# EAGLE design main (EAGLE 7.6.0)
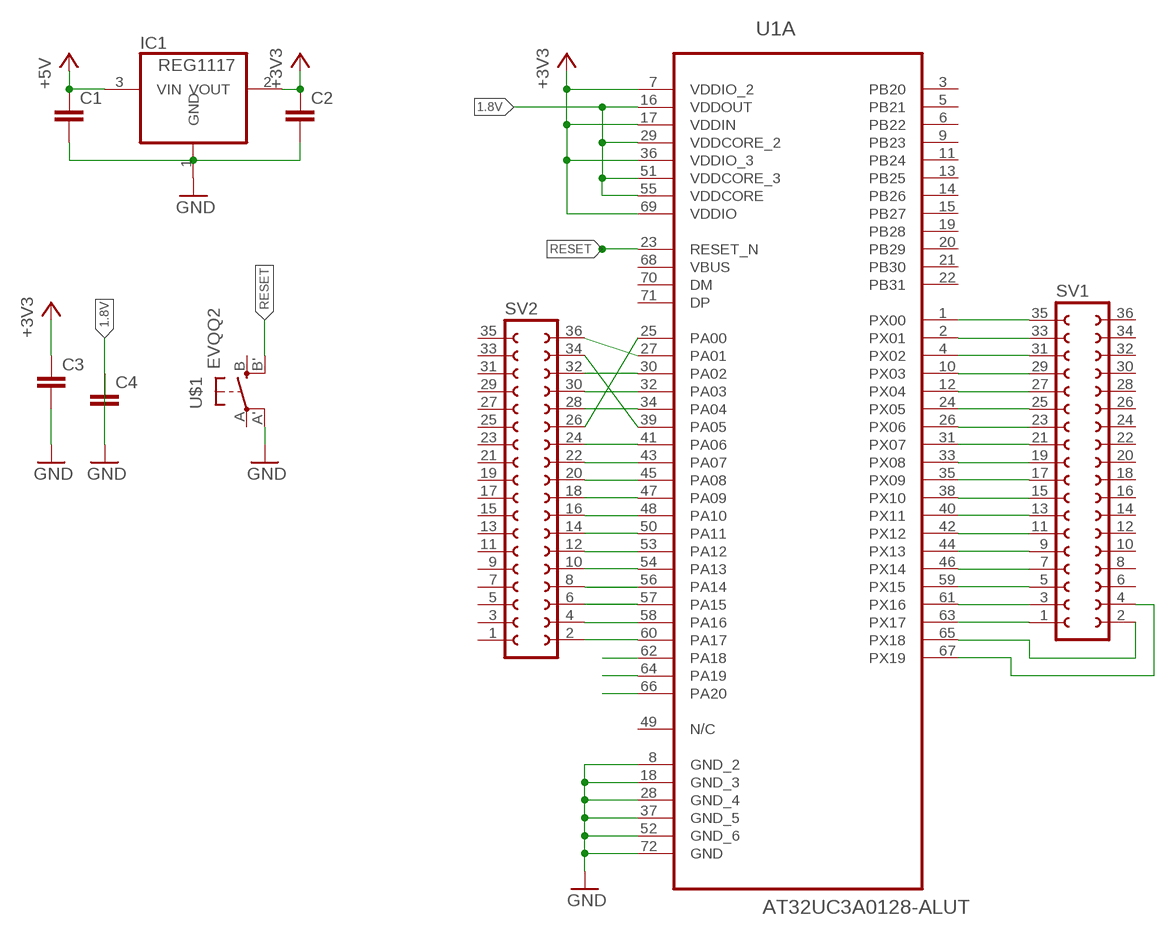
[diagram p0: schematic, sheet 1]

## Parts
C1  C-EUC0805K  [C0805K]
C2  C-EUC0805K  [C0805K]
C3  C-EUC0805K  [C0805K]
C4  C-EUC0805K  [C0805K]
IC1  REG1117  [SOT223]
SV1  FE18-2  [FE18-2]
SV2  FE18-2  [FE18-2]
U1  AT32UC3A0128-ALUT  [QFP50P2200X2200X160-144N]
U$1  EVQQ2  [EVQ-Q2]

## Nets
1.8V: C4.2 U1.16(A:VDDOUT) U1.29(A:VDDCORE_2) U1.51(A:VDDCORE_3) U1.55(A:VDDCORE)
+3V3: C2.1 C3.1 IC1.2(VOUT) U1.7(A:VDDIO_2) U1.17(A:VDDIN) U1.36(A:VDDIO_3) U1.69(A:VDDIO)
+5V: C1.1 IC1.3(VIN)
GND: C3.2 C4.1 IC1.1(GND) U1.8(A:GND_2) U1.18(A:GND_3) U1.28(A:GND_4) U1.37(A:GND_5) U1.52(A:GND_6) U1.72(A:GND) U$1.A'(P1)
N$1: C1.2 C2.2
N$2: SV1.35 U1.1(A:PX00)
N$3: SV1.33 U1.2(A:PX01)
N$4: SV1.31 U1.4(A:PX02)
N$5: SV1.29 U1.10(A:PX03)
N$6: SV1.27 U1.12(A:PX04)
N$7: SV1.25 U1.24(A:PX05)
N$8: SV1.23 U1.26(A:PX06)
N$9: SV1.21 U1.31(A:PX07)
N$10: SV1.19 U1.33(A:PX08)
N$11: SV1.17 U1.35(A:PX09)
N$12: SV1.15 U1.38(A:PX10)
N$13: SV1.13 U1.40(A:PX11)
N$14: SV1.11 U1.42(A:PX12)
N$15: SV1.9 U1.44(A:PX13)
N$16: SV1.7 U1.46(A:PX14)
N$17: SV1.5 U1.59(A:PX15)
N$18: SV1.3 U1.61(A:PX16)
N$19: SV1.1 U1.63(A:PX17)
N$20: SV2.26 U1.25(A:PA00)
N$21: SV2.36 U1.27(A:PA01)
N$22: SV2.32 U1.30(A:PA02)
N$23: SV2.30 U1.32(A:PA03)
N$24: SV2.28 U1.34(A:PA04)
N$25: SV2.34 U1.39(A:PA05)
N$26: SV2.24 U1.41(A:PA06)
N$27: SV2.22 U1.43(A:PA07)
N$28: SV2.20 U1.45(A:PA08)
N$29: SV2.18 U1.47(A:PA09)
N$30: SV2.16 U1.48(A:PA10)
N$31: SV2.14 U1.50(A:PA11)
N$32: SV2.12 U1.53(A:PA12)
N$33: SV2.10 U1.54(A:PA13)
N$34: SV2.8 U1.56(A:PA14)
N$35: SV2.6 U1.57(A:PA15)
N$36: SV2.4 U1.58(A:PA16)
N$37: SV2.2 U1.60(A:PA17)
N$38: U1.62(A:PA18)
N$39: U1.64(A:PA19)
N$40: U1.66(A:PA20)
N$41: SV1.2 U1.65(A:PX18)
N$42: SV1.4 U1.67(A:PX19)
RESET: U1.23(A:RESET_N) U$1.B'(S1)
Unconnected: SV1.6 SV1.8 SV1.10 SV1.12 SV1.14 SV1.16 SV1.18 SV1.20 SV1.22 SV1.24 SV1.26 SV1.28 SV1.30 SV1.32 SV1.34 SV1.36 SV2.1 SV2.3 SV2.5 SV2.7 SV2.9 SV2.11 SV2.13 SV2.15 SV2.17 SV2.19 SV2.21 SV2.23 SV2.25 SV2.27 SV2.29 SV2.31 SV2.33 SV2.35 U1.3(A:PB20) U1.5(A:PB21) U1.6(A:PB22) U1.9(A:PB23) U1.11(A:PB24) U1.13(A:PB25) U1.14(A:PB26) U1.15(A:PB27) U1.19(A:PB28) U1.20(A:PB29) U1.21(A:PB30) U1.22(A:PB31) U1.49(A:N/C) U1.68(A:VBUS) U1.70(A:DM) U1.71(A:DP) U1.73(B:PA21) U1.74(B:PA22) U1.75(B:PA23) U1.76(B:PA24) U1.77(B:PA25) U1.78(B:PA26) U1.79(B:PA27) U1.80(B:PA28) U1.82(B:ADVREF) U1.83(B:GNDANA) U1.85(B:PC00) U1.86(B:PC01) U1.87(B:PX20) U1.88(B:PB00) U1.89(B:PX21) U1.90(B:PB01) U1.91(B:PX22) U1.94(B:GND_2) U1.95(B:PX23) U1.96(B:PB02) U1.97(B:PX24) U1.98(B:PB03) U1.99(B:PX25) U1.100(B:PB04) U1.101(B:PX26) U1.102(B:PB05) U1.103(B:PX27) U1.104(B:PB06) U1.105(B:PX28) U1.106(B:PB07) U1.107(B:PX29) U1.109(B:GND_3) U1.110(B:PX30) U1.111(B:PB08) U1.112(B:PX31) U1.113(B:PB09) U1.114(B:PX32) U1.115(B:PB10) U1.117(B:GND) U1.118(B:PX33) U1.119(B:PB11) U1.120(B:PX34) U1.121(B:PB12) U1.122(B:PA29) U1.123(B:PA30) U1.124(B:PC02) U1.125(B:PC03) U1.126(B:PB13) U1.127(B:PB14) U1.128(B:TMS) U1.129(B:TCK) U1.130(B:TDO) U1.131(B:TDI) U1.132(B:PC04) U1.133(B:PC05) U1.134(B:PB15) U1.135(B:PX35) U1.136(B:PB16) U1.137(B:PX36) U1.139(B:PB17) U1.140(B:PX37) U1.141(B:PB18) U1.142(B:PX38) U1.143(B:PB19) U1.144(B:PX39) U$1.A(P) U$1.B(S)

## Power pins joined to a net without a drawn wire
VDDANA: U1.81(B:VDDANA)
VDDCORE: U1.138(B:VDDCORE)
VDDIO: U1.116(B:VDDIO)
VDDIO_2: U1.92(B:VDDIO_2)
VDDIO_3: U1.93(B:VDDIO_3)
VDDIO_4: U1.108(B:VDDIO_4)
VDDPLL: U1.84(B:VDDPLL)

## Library data of the parts
C1-C4 = rcl:C-EU: CAPACITOR, European symbol
IC1 = burr-brown:REG1117: 800mA and 1A Low Dropout (LDO) Positive Regulator 1.8V, 2.5V, 2.85V, 3.3V, 5V, and Adj; MPN: REG1117; OC_FARNELL: 1097566; OC_NEWARK: 14P6981
SV1 SV2 = con-lsta:FE18-2: FEMALE HEADER; OC_FARNELL: unknown; OC_NEWARK: unknown
U1 = Atmel_By_element14_Batch_1-00:AT32UC3A0128-ALUT: 32-Bit Microcontroller; DESCRIPTION: 32-Bit Microcontroller; MPN: AT32UC3A0128-ALUT; OC_FARNELL: 1841633; OC_NEWARK: 12T1368; PACKAGE: LQFP-144; SUPPLIER: Atmel Corporation
U$1 = adafruit:EVQQ2: SMT 6mm switch, EVQQ2 series http://www.ladyada.net/library/eagle

## Board
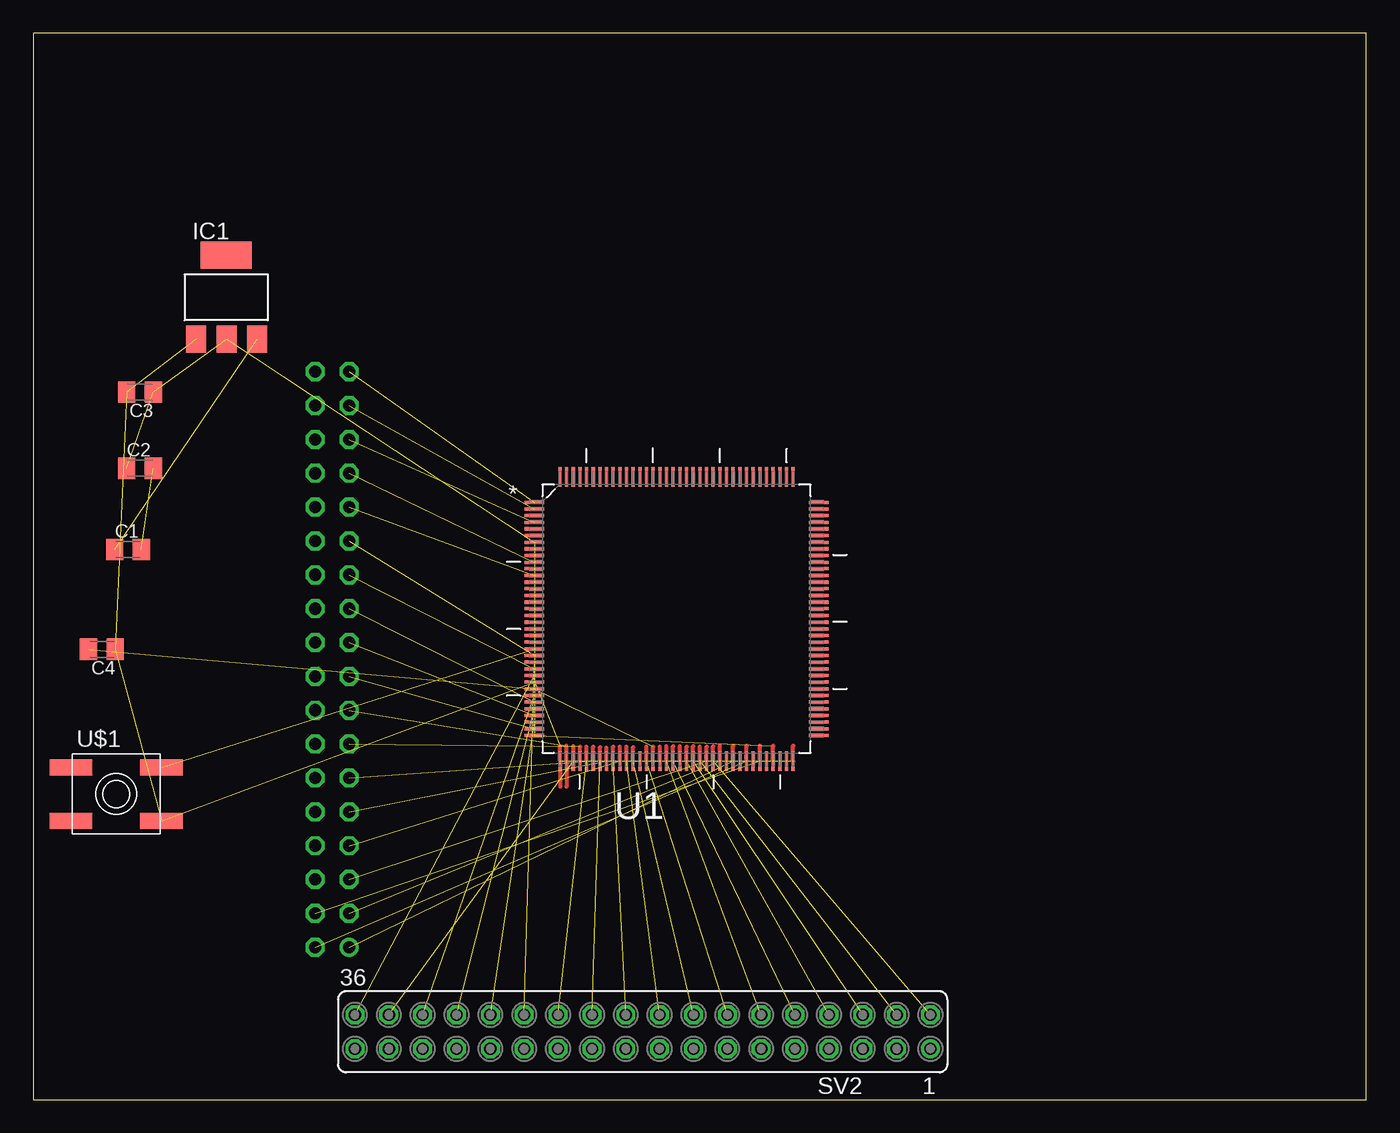
[diagram p1: board, top side]
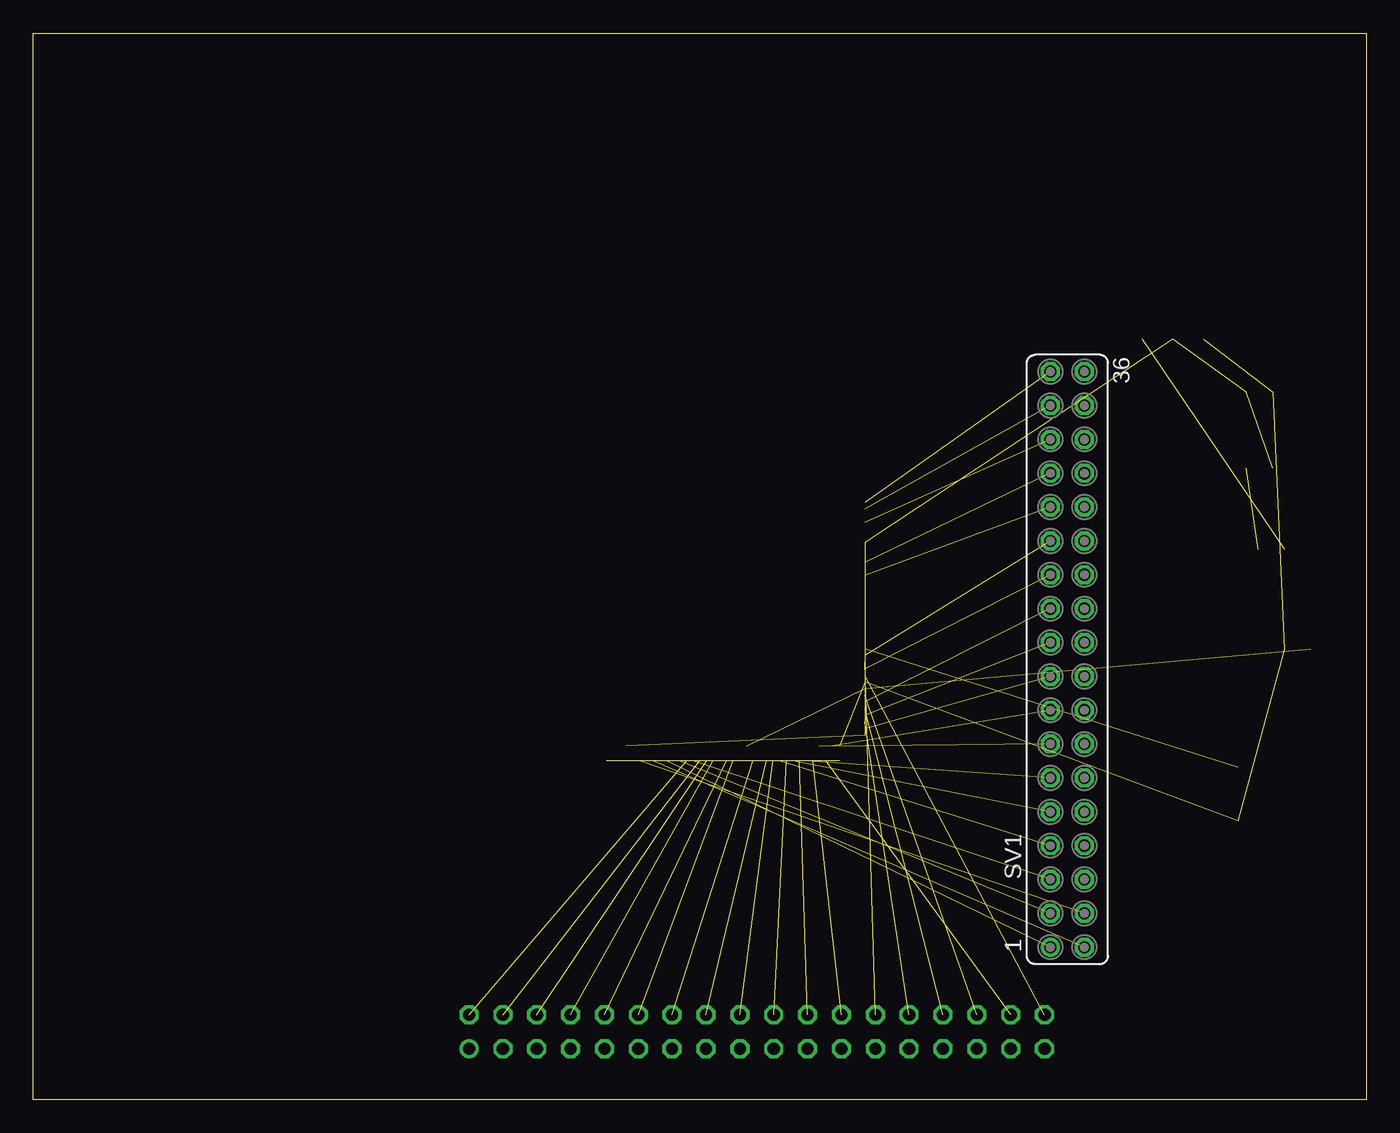
[diagram p2: board, bottom side, seen from below]

Size 100 x 80 mm. Coordinates in mm from the lower left corner, seen from the top.
Outline: 0,0 100,0 100,80 0,80 0,0
Copper layers (1*16): Top 0.035mm / dielectric 1.5mm / Bottom 0.035mm
Design rules "default": minimum track width 10mil, minimum drill 24mil, track to track 8mil, track to pad 8mil, pad to pad 8mil, via to via 8mil, smd to smd 8mil, copper to edge 40mil, drill to drill 8mil, minimum pad ring 10mil, minimum via ring 8mil, stop-mask expansion 4mil, vias tented up to drill 0mil, thermal gap 10mil

### Footprints (pad centres in the part's own frame; a part is rotated, then mirrored left to right if it is on the bottom)
C0805K = smd 1.3 x 1.6: 1 -1,0; 2 1,0
SOT223 = smd 1.499 x 2.007: 1 -2.261,-3.15; 2 0.025,-3.15; 3 2.311,-3.15 | smd 3.81 x 2.007: 4 0,3.15
FE18-2 = drill 0.914: 1 -21.59,1.27 | drill 0.914 octagon: 2 -21.59,-1.27; 3 -19.05,1.27; 4 -19.05,-1.27; 5 -16.51,1.27; 6 -16.51,-1.27; 7 -13.97,1.27; 8 -13.97,-1.27; 9 -11.43,1.27; 10 -11.43,-1.27; 11 -8.89,1.27; 12 -8.89,-1.27; 13 -6.35,1.27; 14 -6.35,-1.27; 15 -3.81,1.27; 16 -3.81,-1.27; 17 -1.27,1.27; 18 -1.27,-1.27; 19 1.27,1.27; 20 1.27,-1.27; 21 3.81,1.27; 22 3.81,-1.27; 23 6.35,1.27; 24 6.35,-1.27; 25 8.89,1.27; 26 8.89,-1.27; 27 11.43,1.27; 28 11.43,-1.27; 29 13.97,1.27; 30 13.97,-1.27; 31 16.51,1.27; 32 16.51,-1.27; 33 19.05,1.27; 34 19.05,-1.27; 35 21.59,1.27; 36 21.59,-1.27
QFP50P2200X2200X160-144N = smd 1.473 x 0.229: 1 -10.668,8.738; 2 -10.668,8.255; 3 -10.668,7.747; 4 -10.668,7.239; 5 -10.668,6.756; 6 -10.668,6.248; 7 -10.668,5.74; 8 -10.668,5.258; 9 -10.668,4.75; 10 -10.668,4.242; 11 -10.668,3.759; 12 -10.668,3.251; 13 -10.668,2.743; 14 -10.668,2.261; 15 -10.668,1.753; 16 -10.668,1.245; 17 -10.668,0.762; 18 -10.668,0.254; 19 -10.668,-0.254; 20 -10.668,-0.762; 21 -10.668,-1.245; 22 -10.668,-1.753; 23 -10.668,-2.261; 24 -10.668,-2.743; 25 -10.668,-3.251; 26 -10.668,-3.759; 27 -10.668,-4.242; 28 -10.668,-4.75; 29 -10.668,-5.258; 30 -10.668,-5.74; 31 -10.668,-6.248; 32 -10.668,-6.756; 33 -10.668,-7.239; 34 -10.668,-7.747; 35 -10.668,-8.255; 36 -10.668,-8.738; 73 10.668,-8.738; 74 10.668,-8.255; 75 10.668,-7.747; 76 10.668,-7.239; 77 10.668,-6.756; 78 10.668,-6.248; 79 10.668,-5.74; 80 10.668,-5.258; 81 10.668,-4.75; 82 10.668,-4.242; 83 10.668,-3.759; 84 10.668,-3.251; 85 10.668,-2.743; 86 10.668,-2.261; 87 10.668,-1.753; 88 10.668,-1.245; 89 10.668,-0.762; 90 10.668,-0.254; 91 10.668,0.254; 92 10.668,0.762; 93 10.668,1.245; 94 10.668,1.753; 95 10.668,2.261; 96 10.668,2.743; 97 10.668,3.251; 98 10.668,3.759; 99 10.668,4.242; 100 10.668,4.75; 101 10.668,5.258; 102 10.668,5.74; 103 10.668,6.248; 104 10.668,6.756; 105 10.668,7.239; 106 10.668,7.747; 107 10.668,8.255; 108 10.668,8.738 | smd 0.229 x 1.473: 37 -8.738,-10.668; 38 -8.255,-10.668; 39 -7.747,-10.668; 40 -7.239,-10.668; 41 -6.756,-10.668; 42 -6.248,-10.668; 43 -5.74,-10.668; 44 -5.258,-10.668; 45 -4.75,-10.668; 46 -4.242,-10.668; 47 -3.759,-10.668; 48 -3.251,-10.668; 49 -2.743,-10.668; 50 -2.261,-10.668; 51 -1.753,-10.668; 52 -1.245,-10.668; 53 -0.762,-10.668; 54 -0.254,-10.668; 55 0.254,-10.668; 56 0.762,-10.668; 57 1.245,-10.668; 58 1.753,-10.668; 59 2.261,-10.668; 60 2.743,-10.668; 61 3.251,-10.668; 62 3.759,-10.668; 63 4.242,-10.668; 64 4.75,-10.668; 65 5.258,-10.668; 66 5.74,-10.668; 67 6.248,-10.668; 68 6.756,-10.668; 69 7.239,-10.668; 70 7.747,-10.668; 71 8.255,-10.668; 72 8.738,-10.668; 109 8.738,10.668; 110 8.255,10.668; 111 7.747,10.668; 112 7.239,10.668; 113 6.756,10.668; 114 6.248,10.668; 115 5.74,10.668; 116 5.258,10.668; 117 4.75,10.668; 118 4.242,10.668; 119 3.759,10.668; 120 3.251,10.668; 121 2.743,10.668; 122 2.261,10.668; 123 1.753,10.668; 124 1.245,10.668; 125 0.762,10.668; 126 0.254,10.668; 127 -0.254,10.668; 128 -0.762,10.668; 129 -1.245,10.668; 130 -1.753,10.668; 131 -2.261,10.668; 132 -2.743,10.668; 133 -3.251,10.668; 134 -3.759,10.668; 135 -4.242,10.668; 136 -4.75,10.668; 137 -5.258,10.668; 138 -5.74,10.668; 139 -6.248,10.668; 140 -6.756,10.668; 141 -7.239,10.668; 142 -7.747,10.668; 143 -8.255,10.668; 144 -8.738,10.668
EVQ-Q2 = smd 3.2 x 1.2: A -3.4,-2; A' 3.4,-2; B -3.4,2; B' 3.4,2

### Placement (x,y rotation side)
C1  7.11,41.27 0 top
C2  8,47.37 0 top
C3  8,53.09 180 top
C4  5.14,33.78 180 top
IC1  14.48,60.2 0 top
SV1  22.42,33.02 90 bottom
SV2  45.72,5.08 180 top
U1  48.26,36.07 0 top
U$1  6.22,22.92 0 top

### Tracks (layer width: path | path; a pad name or v marks a point on that pad's centre or on a via)
1.8V  (4 unrouted)
  Top 0.305: U1.51 46.51,26.49 | U1.55 48.51,26.52
+3V3  (6 unrouted)
  Top 0.305: U1.69 55.5,26.54
+5V  (1 unrouted)
GND  (9 unrouted)
  Top 0.305: 39.52,26.52 U1.37 39.52,23.47 | U1.52 47.02,26.49 | U1.72 57,26.57
N$1  (1 unrouted)
N$2  (1 unrouted)
N$3  (1 unrouted)
N$4  (1 unrouted)
N$5  (1 unrouted)
N$6  (1 unrouted)
N$7  (1 unrouted)
N$8  (1 unrouted)
N$9  (1 unrouted)
N$10  (1 unrouted)
N$11  (1 unrouted)
N$12  (1 unrouted)
  Top 0.305: 40.01,23.47 U1.38 40.01,26.54
N$13  (1 unrouted)
  Top 0.305: U1.40 41.02,26.49
N$14  (1 unrouted)
  Top 0.305: U1.42 42.01,26.47
N$15  (1 unrouted)
  Top 0.305: U1.44 43,26.42
N$16  (1 unrouted)
  Top 0.305: U1.46 44.02,26.47
N$17  (1 unrouted)
  Top 0.305: U1.59 50.52,26.49
N$18  (1 unrouted)
  Top 0.305: U1.61 51.51,26.54
N$19  (1 unrouted)
  Top 0.305: U1.63 52.5,26.57
N$20  (1 unrouted)
N$21  (1 unrouted)
N$22  (1 unrouted)
N$23  (1 unrouted)
N$24  (1 unrouted)
N$25  (1 unrouted)
  Top 0.305: U1.39 40.51,26.52
N$26  (1 unrouted)
  Top 0.305: U1.41 41.5,26.49
N$27  (1 unrouted)
  Top 0.305: U1.43 42.52,26.44
N$28  (1 unrouted)
  Top 0.305: U1.45 43.51,26.49
N$29  (1 unrouted)
  Top 0.305: U1.47 44.5,26.49
N$30  (1 unrouted)
  Top 0.305: U1.48 45.01,26.44
N$31  (1 unrouted)
  Top 0.305: U1.50 46,26.47
N$32  (1 unrouted)
  Top 0.305: U1.53 47.5,26.52
N$33  (1 unrouted)
  Top 0.305: U1.54 48.01,26.52
N$34  (1 unrouted)
  Top 0.305: U1.56 49.02,26.49
N$35  (1 unrouted)
  Top 0.305: U1.57 49.51,26.52
N$36  (1 unrouted)
  Top 0.305: U1.58 50.01,26.49
N$37  (1 unrouted)
  Top 0.305: U1.60 51,26.52
N$41  (1 unrouted)
  Top 0.305: U1.65 53.52,26.54
N$42  (1 unrouted)
  Top 0.305: U1.67 54.51,26.54
RESET  (1 unrouted)